# EAGLE design E-P-099-R2.8 (EAGLE 9.0.0)
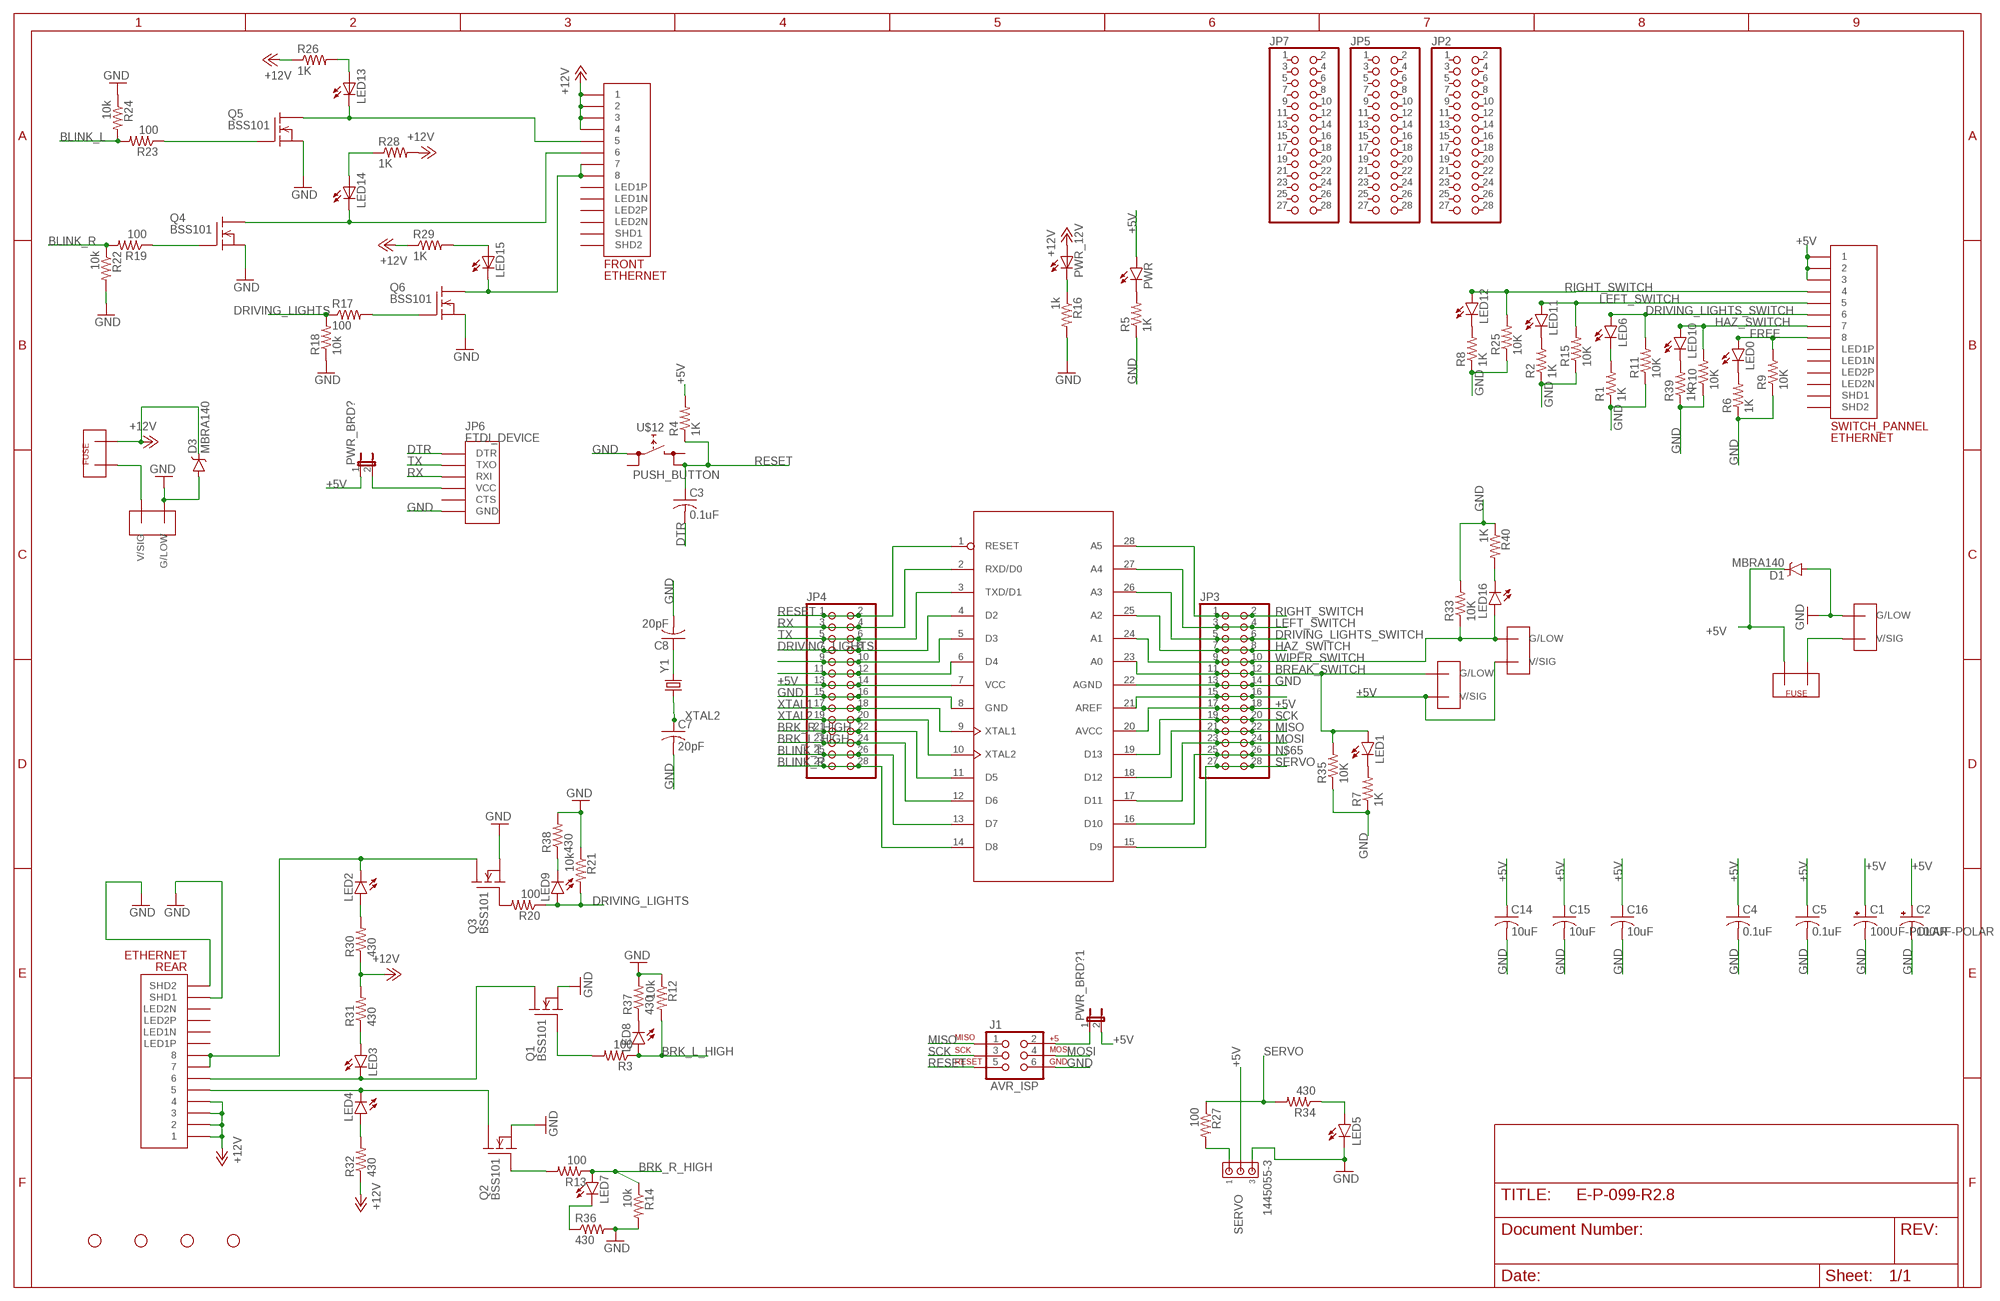
[diagram p0: schematic, sheet 1]

## Parts
C1  100UF-POLAR  [EEU-FR1H101]
C2  100UF-POLAR  [EEU-FR1H101]
C3  0.1uF  C-USC0805  [C0805]
C4  0.1uF  C-USC0805  [C0805]
C5  0.1uF  C-USC0805  [C0805]
C7  20pF  C-USC0805  [C0805]
C8  20pF  C-USC0805  [C0805]
C14  10uF  C-USC0805  [C0805]
C15  10uF  C-USC0805  [C0805]
C16  10uF  C-USC0805  [C0805]
D1  MBRA140  [SMA-DIODE]
D3  MBRA140  [SMA-DIODE]
FRONT  ETHERNET  [A122645-ND]
J1  AVR_ISP  AVR_SPI_PRG_6PTH  [2X3]
JP2  PINHD-2X14  [2X14]
JP3  PINHD-2X14  [2X14]
JP4  PINHD-2X14  [2X14]
JP5  PINHD-2X14  [2X14]
JP6  FTDI_DEVICE  [FTDI_DEVICE_SIDE]
JP7  PINHD-2X14  [2X14]
LED0  LED0603  [LED-0603]
LED1  LED0603  [LED-0603]
LED2  LED0603  [LED-0603]
LED3  LED0603  [LED-0603]
LED4  LED0603  [LED-0603]
LED5  LED0603  [LED-0603]
LED6  LED0603  [LED-0603]
LED7  LED0603  [LED-0603]
LED8  LED0603  [LED-0603]
LED9  LED0603  [LED-0603]
LED10  LED0603  [LED-0603]
LED11  LED0603  [LED-0603]
LED12  LED0603  [LED-0603]
LED13  LEDCHIPLED_0805  [CHIPLED_0805]
LED14  LEDCHIPLED_0805  [CHIPLED_0805]
LED15  LEDCHIPLED_0805  [CHIPLED_0805]
LED16  LED0603  [LED-0603]
PWR  LED0603  [LED-0603]
PWR_12V  LEDCHIPLED_1206  [CHIPLED_1206]
PWR_BRD?  JP1E  [JP1]
PWR_BRD?1  JP1E  [JP1]
Q1  BSS101  [TO92]
Q2  BSS101  [TO92]
Q3  BSS101  [TO92]
Q4  BSS101  [TO92]
Q5  BSS101  [TO92]
Q6  BSS101  [TO92]
R1  1K  RESISTOR0805-RES  [0805]
R2  1K  RESISTOR0805-RES  [0805]
R3  100  RESISTOR0805-RES  [0805]
R4  1K  RESISTOR0805-RES  [0805]
R5  1K  RESISTOR0805-RES  [0805]
R6  1K  RESISTOR0805-RES  [0805]
R7  1K  RESISTOR0805-RES  [0805]
R8  1K  RESISTOR0805-RES  [0805]
R9  10K  R-US_R0805  [R0805]
R10  10K  R-US_R0805  [R0805]
R11  10K  R-US_R0805  [R0805]
R12  10k  RESISTOR0805-RES  [0805]
R13  100  RESISTOR0805-RES  [0805]
R14  10k  RESISTOR0805-RES  [0805]
R15  10K  R-US_R0805  [R0805]
R16  1k  RESISTOR0805-RES  [0805]
R17  100  RESISTOR0805-RES  [0805]
R18  10k  RESISTOR0805-RES  [0805]
R19  100  RESISTOR0805-RES  [0805]
R20  100  RESISTOR0805-RES  [0805]
R21  10k  RESISTOR0805-RES  [0805]
R22  10k  RESISTOR0805-RES  [0805]
R23  100  RESISTOR0805-RES  [0805]
R24  10k  RESISTOR0805-RES  [0805]
R25  10K  R-US_R0805  [R0805]
R26  1K  RESISTOR0805-RES  [0805]
R27  100  RESISTOR0805-RES  [0805]
R28  1K  RESISTOR0805-RES  [0805]
R29  1K  RESISTOR0805-RES  [0805]
R30  430  RESISTOR0805-RES  [0805]
R31  430  RESISTOR0805-RES  [0805]
R32  430  RESISTOR0805-RES  [0805]
R33  10K  R-US_R0805  [R0805]
R34  430  RESISTOR0805-RES  [0805]
R35  10K  R-US_R0805  [R0805]
R36  430  RESISTOR0805-RES  [0805]
R37  430  RESISTOR0805-RES  [0805]
R38  430  RESISTOR0805-RES  [0805]
R39  1K  RESISTOR0805-RES  [0805]
R40  1K  RESISTOR0805-RES  [0805]
REAR  ETHERNET  [A122645-ND]
SERVO  1445055-3  [1445055-3]
STANDOFF1  STAND-OFF  [STAND-OFF]
STANDOFF2  STAND-OFF  [STAND-OFF]
STANDOFF3  STAND-OFF  [STAND-OFF]
STANDOFF4  STAND-OFF  [STAND-OFF]
SWITCH_PANNEL  ETHERNET  [A122645-ND]
U$1  TE770966  [2X1-MATE-N-LOCK]
U$2  FUSEMINI-BLADE  [MINI-BLADE-FUSE]
U$3  TE770966  [2X1-MATE-N-LOCK]
U$4  ATMEGA328  [DIP28-0.3IN]
U$5  TE770966  [2X1-MATE-N-LOCK]
U$8  TE770966  [2X1-MATE-N-LOCK]
U$9  FUSEMINI-BLADE  [MINI-BLADE-FUSE]
U$12  PUSH_BUTTON  [PUSHBUTTON]
Y1  CRYSTALHC49US  [HC49US]

## Nets
+5V: C1.P(+) C2.P(+) C4.1 C5.1 C14.1 C15.1 C16.1 D1.C JP3.17 JP3.18 JP4.13 JP4.14 PWR.A PWR_BRD?1.2 PWR_BRD?.1 R4.2 SERVO.2 SWITCH_PANNEL.P$1 SWITCH_PANNEL.P$2 SWITCH_PANNEL.P$3 U$2.OUT U$3.CIRCUIT1(V/SIG) U$4.7(VCC) U$4.20(AVCC) U$5.CIRCUIT1(V/SIG)
+12V: D3.C FRONT.P$1 FRONT.P$2 FRONT.P$3 FRONT.P$4 PWR_12V.A R26.1 R28.2 R29.1 R30.1 R31.2 R32.1 REAR.P$1 REAR.P$2 REAR.P$3 REAR.P$4 U$9.OUT
BLINK_L: JP4.25 JP4.26 R23.2 R24.2 U$4.13(D7)
BLINK_R: JP4.27 JP4.28 R19.2 R22.1 U$4.14(D8)
BREAK_SWITCH: JP3.11 JP3.12 LED1.A R35.2 U$3.CIRCUIT2(G/LOW) U$4.23(A0)
BRK_L_HIGH: JP4.23 JP4.24 LED8.A R3.1 R12.2 U$4.12(D6)
BRK_R_HIGH: JP4.21 JP4.22 LED7.A R13.1 R14.1 U$4.11(D5)
DRIVING_LIGHTS: JP4.7 JP4.8 LED9.A R17.1 R18.2 R20.1 R21.2 U$4.4(D2)
DRIVING_LIGHTS_SWITCH: JP3.5 JP3.6 LED6.A R11.2 SWITCH_PANNEL.P$6 U$4.26(A3)
DTR: C3.2 JP6.P$1(DTR)
FREE: LED0.A R9.2 SWITCH_PANNEL.P$8
GND: C1.G(-) C2.G(-) C4.2 C5.2 C7.2 C8.2 C14.2 C15.2 C16.2 D1.A D3.A J1.6 JP3.13 JP3.14 JP4.15 JP4.16 JP6.P$6(GND) LED5.C Q1.1(S) Q2.1(S) Q3.1(S) Q4.1(S) Q5.1(S) Q6.1(S) R1.1 R2.1 R5.1 R6.1 R7.1 R8.1 R9.1 R10.1 R11.1 R12.1 R14.2 R15.1 R16.2 R18.1 R21.1 R22.2 R24.1 R25.1 R33.2 R35.1 R36.2 R37.2 R38.2 R39.1 R40.1 REAR.P$13(SHD1) REAR.P$14(SHD2) SERVO.3 U$1.CIRCUIT2(G/LOW) U$4.8(GND) U$4.22(AGND) U$8.CIRCUIT2(G/LOW) U$12.L1(L)
HAZ_SWITCH: JP3.7 JP3.8 LED10.A R10.2 SWITCH_PANNEL.P$7 U$4.25(A2)
LEFT_SWITCH: JP3.3 JP3.4 LED11.A R15.2 SWITCH_PANNEL.P$5 U$4.27(A4)
MISO: J1.1 JP3.21 JP3.22 U$4.18(D12)
MOSI: J1.4 JP3.23 JP3.24 U$4.17(D11)
N$1: LED12.C R8.2
N$2: LED6.C R1.2
N$3: LED11.C R2.2
N$4: LED2.C Q3.3(D) REAR.P$7 REAR.P$8
N$5: LED3.C Q1.3(D) REAR.P$6
N$6: U$1.CIRCUIT1(V/SIG) U$2.IN
N$7: LED4.C Q2.3(D) REAR.P$5
N$8: Q3.2(G) R20.2
N$9: JP6.P$4(VCC) PWR_BRD?.2
N$10: LED0.C R6.2
N$11: LED1.C R7.2
N$12: LED5.A R34.1
N$13: R27.2 SERVO.1
N$14: Q2.2(G) R13.2
N$15: Q1.2(G) R3.2
N$16: PWR_12V.C R16.1
N$17: Q5.2(G) R23.1
N$18: LED4.A R32.2
N$19: PWR.C R5.2
N$20: FRONT.P$7 FRONT.P$8 LED15.C Q6.3(D)
N$21: FRONT.P$6 LED14.C Q4.3(D)
N$22: FRONT.P$5 LED13.C Q5.3(D)
N$23: LED3.A R31.1
N$24: C8.1 Y1.2
N$25: JP4.11 JP4.12 U$4.6(D4)
N$26: JP4.9 JP4.10 U$4.5(D3)
N$27: LED2.A R30.2
N$28: LED16.C R40.2
N$32: LED13.A R26.2
N$33: Q4.2(G) R19.1
N$34: LED14.A R28.1
N$35: Q6.2(G) R17.2
N$36: LED15.A R29.2
N$37: J1.2 PWR_BRD?1.1
N$41: LED7.C R36.1
N$42: LED8.C R37.1
N$44: LED9.C R38.1
N$46: LED10.C R39.2
N$47: U$8.CIRCUIT1(V/SIG) U$9.IN
N$60: JP3.15 JP3.16 U$4.21(AREF)
N$65: JP3.25 JP3.26 U$4.16(D10)
RESET: C3.1 J1.5 JP4.1 JP4.2 R4.1 U$4.1(RESET) U$12.R2(R)
RIGHT_SWITCH: JP3.1 JP3.2 LED12.A R25.2 SWITCH_PANNEL.P$4 U$4.28(A5)
RX: JP4.3 JP4.4 JP6.P$3(RXI) U$4.2(RXD/D0)
SCK: J1.3 JP3.19 JP3.20 U$4.19(D13)
SERVO: JP3.27 JP3.28 R27.1 R34.2 U$4.15(D9)
TX: JP4.5 JP4.6 JP6.P$2(TXO) U$4.3(TXD/D1)
WIPER_SWITCH: JP3.9 JP3.10 LED16.A R33.1 U$4.24(A1) U$5.CIRCUIT2(G/LOW)
XTAL1: JP4.17 JP4.18 U$4.9(XTAL1)
XTAL2: C7.1 JP4.19 JP4.20 U$4.10(XTAL2) Y1.1
Unconnected: FRONT.P$9(LED1N) FRONT.P$10(LED1P) FRONT.P$11(LED2N) FRONT.P$12(LED2P) FRONT.P$13(SHD1) FRONT.P$14(SHD2) JP2.1 JP2.2 JP2.3 JP2.4 JP2.5 JP2.6 JP2.7 JP2.8 JP2.9 JP2.10 JP2.11 JP2.12 JP2.13 JP2.14 JP2.15 JP2.16 JP2.17 JP2.18 JP2.19 JP2.20 JP2.21 JP2.22 JP2.23 JP2.24 JP2.25 JP2.26 JP2.27 JP2.28 JP5.1 JP5.2 JP5.3 JP5.4 JP5.5 JP5.6 JP5.7 JP5.8 JP5.9 JP5.10 JP5.11 JP5.12 JP5.13 JP5.14 JP5.15 JP5.16 JP5.17 JP5.18 JP5.19 JP5.20 JP5.21 JP5.22 JP5.23 JP5.24 JP5.25 JP5.26 JP5.27 JP5.28 JP6.P$5(CTS) JP7.1 JP7.2 JP7.3 JP7.4 JP7.5 JP7.6 JP7.7 JP7.8 JP7.9 JP7.10 JP7.11 JP7.12 JP7.13 JP7.14 JP7.15 JP7.16 JP7.17 JP7.18 JP7.19 JP7.20 JP7.21 JP7.22 JP7.23 JP7.24 JP7.25 JP7.26 JP7.27 JP7.28 REAR.P$9(LED1N) REAR.P$10(LED1P) REAR.P$11(LED2N) REAR.P$12(LED2P) SWITCH_PANNEL.P$9(LED1N) SWITCH_PANNEL.P$10(LED1P) SWITCH_PANNEL.P$11(LED2N) SWITCH_PANNEL.P$12(LED2P) SWITCH_PANNEL.P$13(SHD1) SWITCH_PANNEL.P$14(SHD2) U$12.L2(L) U$12.R1(R)

## Library data of the parts
C1 C2 = 100uF_Cap:100UF-POLAR: 100µF polarized capacitors A capacitor is a passive two-terminal electrical component used to store electrical energy temporarily in an electric field.
C3-C5 C7 C8 C14-C16 = adafruit:C-US: CAPACITOR, American symbol
D1 D3 = SparkFun-DiscreteSemi:MBRA140: 40V, 1A Schottky rectifier SMA/DO-214AC package DIO-08053; PROD_ID: DIO-08053
FRONT REAR SWITCH_PANNEL = ETHERNET-3:ETHERNET: Ethernet port with 2 leds. digikey number A122645-ND
J1 = E-P-099-R2.2:AVR_SPI_PRG_6: AVR ISP 6 Pin This is the reduced ISP connector for AVR programming. Common on Arduino. This footprint will take up less PCB space and can be used with a 10-pin to 6-pin adapter such as SKU: BOB-08508
JP2-JP5 JP7 = E-P-099-R2.2:PINHD-2X14: PIN HEADER
JP6 = SparkFun-Connectors:FTDI_DEVICE: Connector which mates to FTDI basic or FTDI cable.
LED0 LED1-LED12 LED16 PWR = SparkFun-LED:LED: LEDs Standard schematic elements and footprints for 5mm, 3mm, 1206, and 0603 sized LEDs. 5mm - Spark Fun Electronics SKU : COM-00529 (and others)
LED13-LED15 = led:LED: LED OSRAM: - CHIPLED LG R971, LG N971, LY N971, LG Q971, LY Q971, LO R971, LY R971 LH N974, LH R974 LS Q976, LO Q976, LY Q976 LO Q996 - Hyper CHIPLED LW Q18S LB Q993, LB Q99A, LB R99A - SideLED LS A670, LO A670, LY A670, LG A670, LP A670 LB A673, LV A673, LT A673, LW A673 LH A674 LY A675 LS A676, LA A676, LO A676, LY A676, LW A676 LS A679, LY A679, LG A679 - Hyper Micro SIDELED® LS Y876, LA Y876, LO Y876, LY Y876 LT Y87S - SmartLED LW L88C, LW L88S LB L89C, LB L89S, LG L890 LS L89K, LO L89K, LY L89K LS L896, LA L896, LO L896, LY L896 - TOPLED LS T670, LO T670, LY T670, LG T670, LP T670 LSG T670, LSP T670, LSY T670, LOP T670, LYG T670 LG T671, LOG T671, LSG T671 LB T673, LV T673, LT T673, LW T673 LH T674 LS T676, LA T676, LO T676, LY T676, LB T676, LH T676, LSB T676, LW T676 LB T67C, LV T67C, LT T67C, LS T67K, LO T67K, LY T67K, LW E67C LS E67B, LA E67B, LO E67B, LY E67B, LB E67C, LV E67C, LT E67C LW T67C LS T679, LY T679, LG T679 LS T770, LO T770, LY T770, LG T770, LP T770 LB T773, LV T773, LT T773, LW T773 LH T774 LS E675, LA E675, LY E675, LS T675 LS T776, LA T776, LO T776, LY T776, LB T776 LHGB T686 LT T68C, LB T68C - Hyper Mini TOPLED® LB M676 - Mini TOPLED Santana® LG M470 LS M47K, LO M47K, LY M47K Source: http://www.osram.convergy.de LUXEON: - LUMILED® LXK2-PW12-R00, LXK2-PW12-S00, LXK2-PW14-U00, LXK2-PW14-V00 LXK2-PM12-R00, LXK2-PM12-S00, LXK2-PM14-U00 LXK2-PE12-Q00, LXK2-PE12-R00, LXK2-PE12-S00, LXK2-PE14-T00, LXK2-PE14-U00 LXK2-PB12-K00, LXK2-PB12-L00, LXK2-PB12-M00, LXK2-PB14-N00, LXK2-PB14-P00, LXK2-PB14-Q00 LXK2-PR12-L00, LXK2-PR12-M00, LXK2-PR14-Q00, LXK2-PR14-R00 LXK2-PD12-Q00, LXK2-PD12-R00, LXK2-PD12-S00 LXK2-PH12-R00, LXK2-PH12-S00 LXK2-PL12-P00, LXK2-PL12-Q00, LXK2-PL12-R00 Source: www.luxeon.com KINGBRIGHT: KA-3528ASYC Source: www.kingbright.com
PWR_12V = E14-P-099-R21.2(US_drills):LED: LED OSRAM: - CHIPLED LG R971, LG N971, LY N971, LG Q971, LY Q971, LO R971, LY R971 LH N974, LH R974 LS Q976, LO Q976, LY Q976 LO Q996 - Hyper CHIPLED LW Q18S LB Q993, LB Q99A, LB R99A - SideLED LS A670, LO A670, LY A670, LG A670, LP A670 LB A673, LV A673, LT A673, LW A673 LH A674 LY A675 LS A676, LA A676, LO A676, LY A676, LW A676 LS A679, LY A679, LG A679 - Hyper Micro SIDELED® LS Y876, LA Y876, LO Y876, LY Y876 LT Y87S - SmartLED LW L88C, LW L88S LB L89C, LB L89S, LG L890 LS L89K, LO L89K, LY L89K LS L896, LA L896, LO L896, LY L896 - TOPLED LS T670, LO T670, LY T670, LG T670, LP T670 LSG T670, LSP T670, LSY T670, LOP T670, LYG T670 LG T671, LOG T671, LSG T671 LB T673, LV T673, LT T673, LW T673 LH T674 LS T676, LA T676, LO T676, LY T676, LB T676, LH T676, LSB T676, LW T676 LB T67C, LV T67C, LT T67C, LS T67K, LO T67K, LY T67K, LW E67C LS E67B, LA E67B, LO E67B, LY E67B, LB E67C, LV E67C, LT E67C LW T67C LS T679, LY T679, LG T679 LS T770, LO T770, LY T770, LG T770, LP T770 LB T773, LV T773, LT T773, LW T773 LH T774 LS E675, LA E675, LY E675, LS T675 LS T776, LA T776, LO T776, LY T776, LB T776 LHGB T686 LT T68C, LB T68C - Hyper Mini TOPLED® LB M676 - Mini TOPLED Santana® LG M470 LS M47K, LO M47K, LY M47K Source: http://www.osram.convergy.de LUXEON: - LUMILED® LXK2-PW12-R00, LXK2-PW12-S00, LXK2-PW14-U00, LXK2-PW14-V00 LXK2-PM12-R00, LXK2-PM12-S00, LXK2-PM14-U00 LXK2-PE12-Q00, LXK2-PE12-R00, LXK2-PE12-S00, LXK2-PE14-T00, LXK2-PE14-U00 LXK2-PB12-K00, LXK2-PB12-L00, LXK2-PB12-M00, LXK2-PB14-N00, LXK2-PB14-P00, LXK2-PB14-Q00 LXK2-PR12-L00, LXK2-PR12-M00, LXK2-PR14-Q00, LXK2-PR14-R00 LXK2-PD12-Q00, LXK2-PD12-R00, LXK2-PD12-S00 LXK2-PH12-R00, LXK2-PH12-S00 LXK2-PL12-P00, LXK2-PL12-Q00, LXK2-PL12-R00 Source: www.luxeon.com KINGBRIGHT: KA-3528ASYC Source: www.kingbright.com
PWR_BRD? PWR_BRD?1 = E-P-099-R2.2:JP1E: JUMPER
Q1-Q6 = transistor-fet:BSS101: N-Channel Enhancement MOSFET 200V; 0,16A; 11Ohm
R1-R8 R12-R14 R16-R24 R26-R32 R34 R36-R40 = SparkFun-Passives:RESISTOR: Resistor Basic schematic elements and footprints for 0603, 1206, and PTH resistors.
R9-R11 R15 R25 R33 R35 = resistor:R-US_: RESISTOR, American symbol
SERVO = con-amp:1445055-3: Micro MATE-N-LOK Connectors grid 1.5 mm Source: ENG_CD_1445055_A.pdf
STANDOFF1-STANDOFF4 = SparkFun-Electromechanical:STAND-OFF: #4 Stand Off This is the mechanical footprint for a #4 phillips button head screw. Use the keepout ring to avoid running the screw head into surrounding components. SKU : PRT-00447
U$1 U$3 U$5 U$8 = Shell2013(1):TE770966
U$2 U$9 = Shell2013:FUSE
U$4 = E-P-099-R2.2:ATMEGA328
U$12 = E-P-099-R2.2:PUSH_BUTTON
Y1 = SparkFun-FreqCtrl:CRYSTAL: Various standard crystals. Proven footprints.

## Board
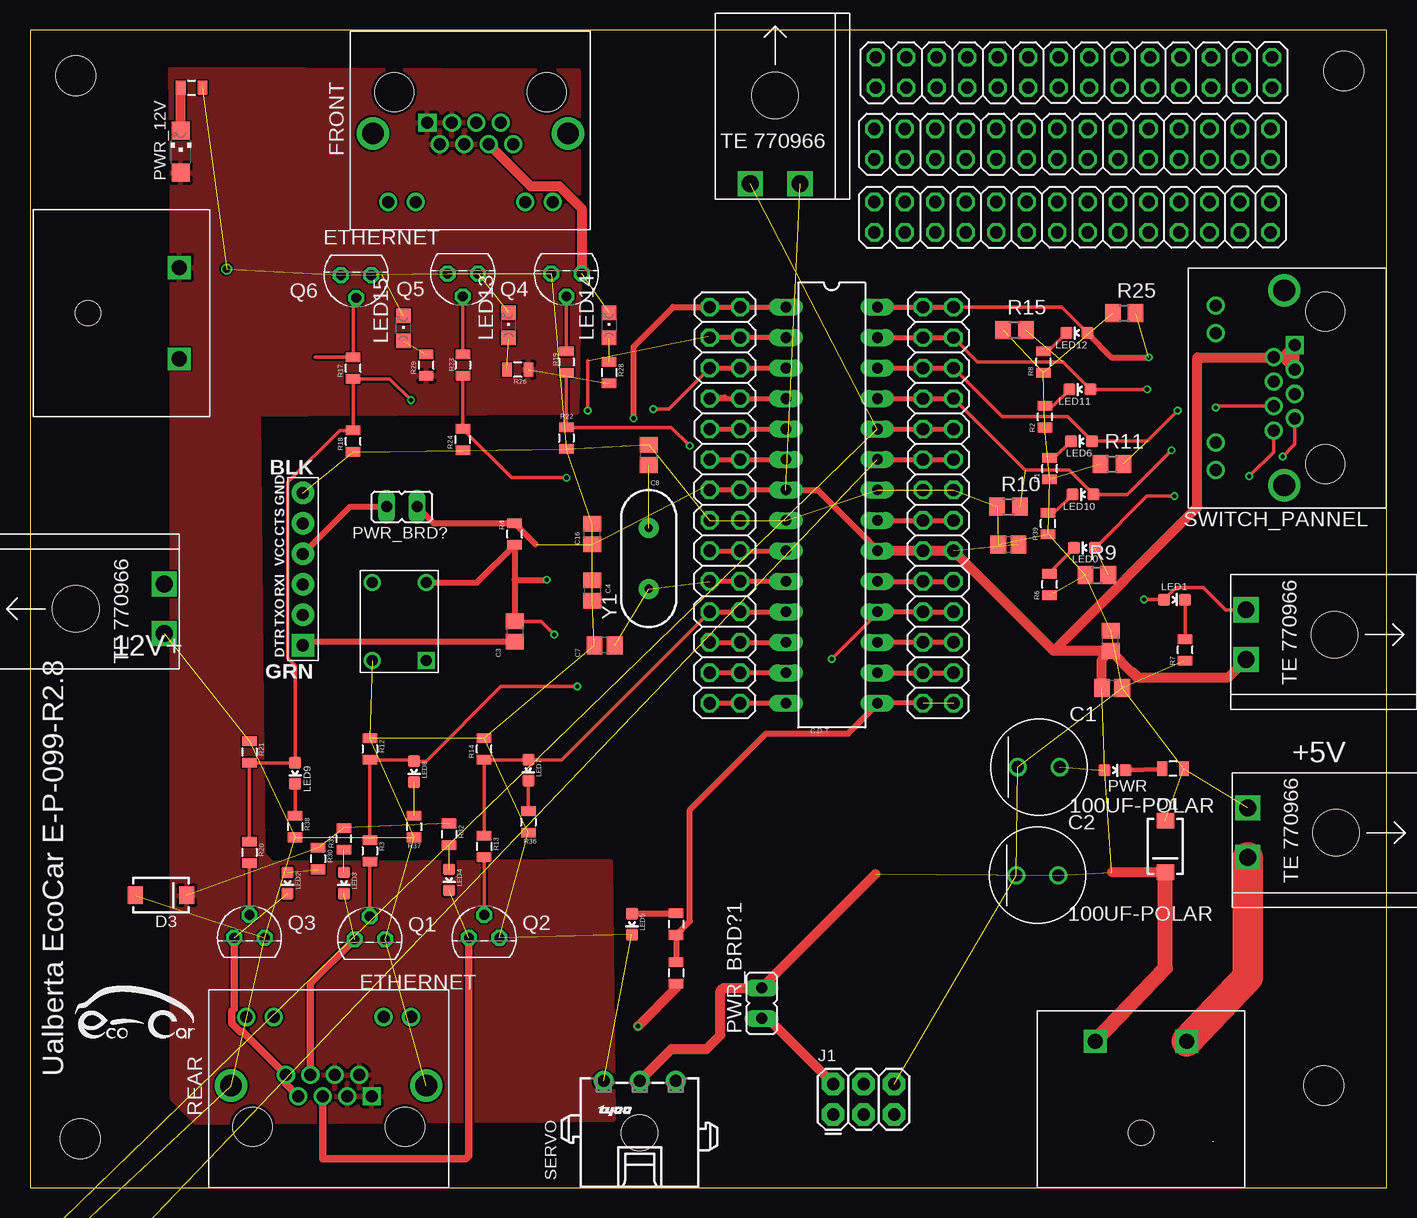
[diagram p1: board, top side]
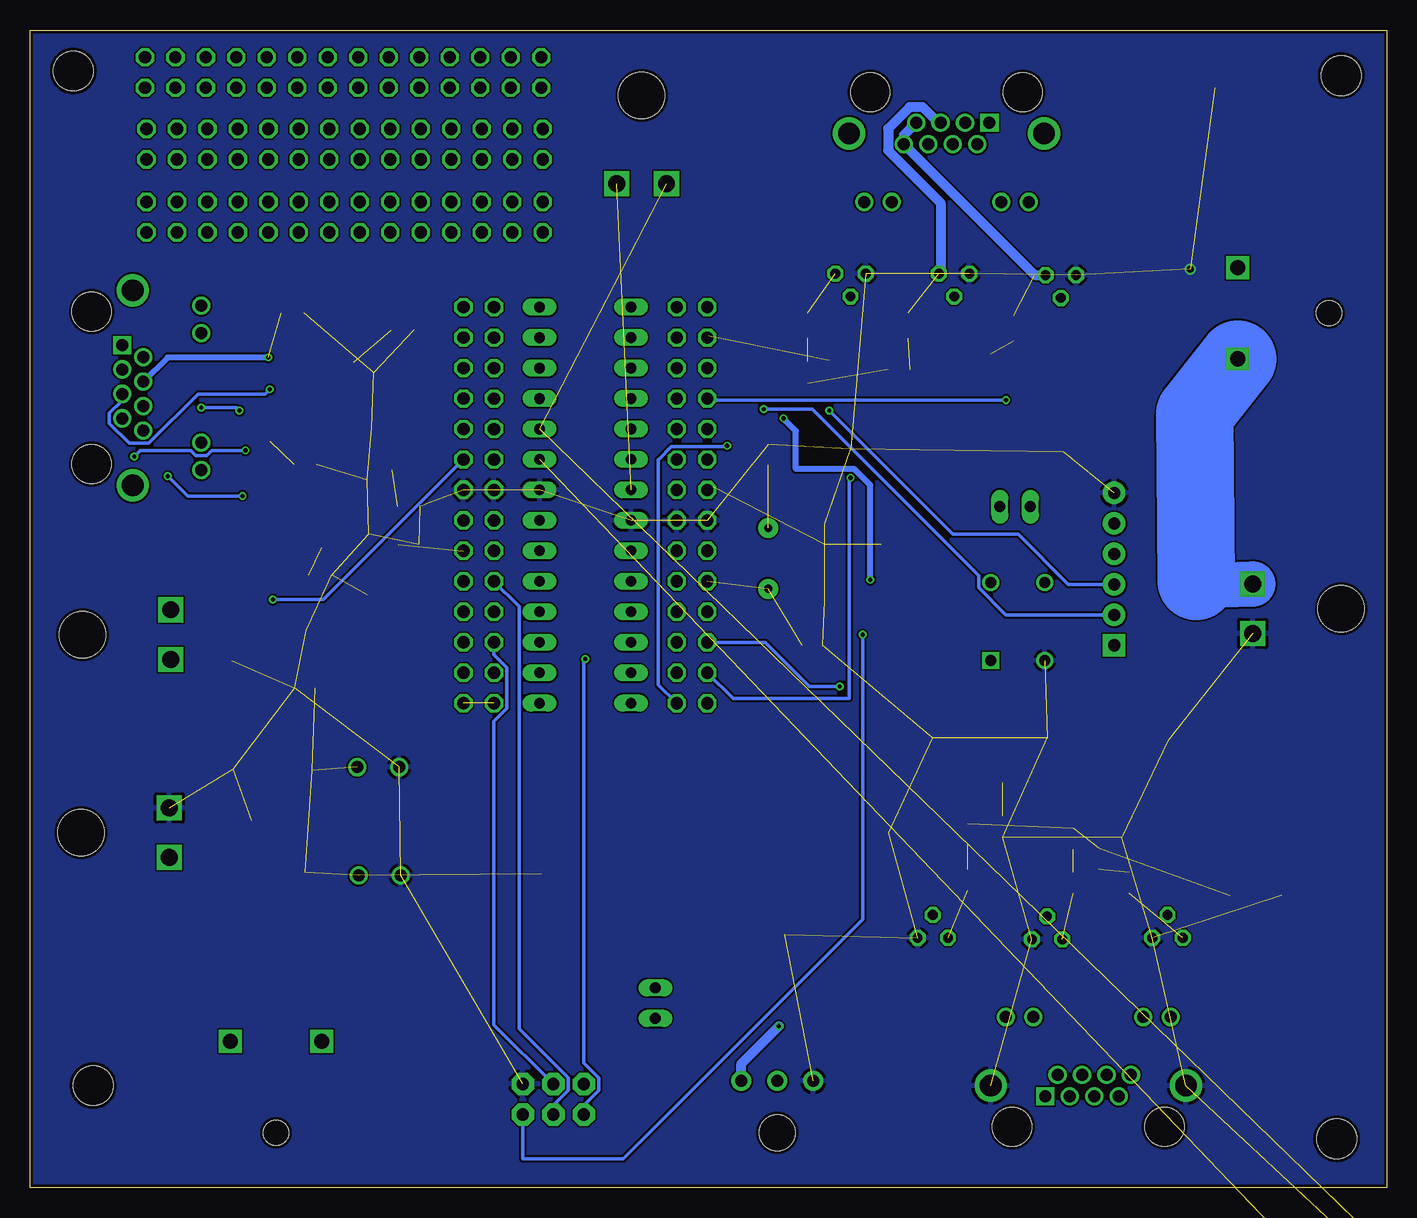
[diagram p2: board, bottom side, seen from below]

Size 113.08 x 96.51 mm. Coordinates in mm from the lower left corner, seen from the top.
Outline: 0,0 113.08,0 113.08,96.51 0,96.51 0,0
Copper layers (1*16): Top 0.035mm / dielectric 1.5mm / Bottom 0.035mm
Design rules "SeeedStudio_2layer_DRU_no_angle_20140221": minimum track width 6mil, minimum drill 12mil, track to track 6mil, track to pad 6mil, pad to pad 6mil, via to via 6mil, smd to smd 0mil, copper to edge 10mil, drill to drill 10mil, minimum pad ring 10mil, minimum via ring 6mil, stop-mask expansion 2mil, vias tented up to drill 100mil, thermal gap 10mil

### Footprints (pad centres in the part's own frame; a part is rotated, then mirrored left to right if it is on the bottom)
EEU-FR1H101 = drill 1: G -1.75,0; P 1.75,0
C0805 = smd 1.3 x 1.5: 1 -0.85,0; 2 0.85,0
SMA-DIODE = smd 1.27 x 1.47: A -2.15,0; C 2.15,0
A122645-ND = drill 1 square: P$1 3.58,2.54 | drill 1: P$2 2.56,4.32; P$3 1.54,2.54; P$4 0.52,4.32; P$5 -0.5,2.54; P$6 -1.52,4.32; P$7 -2.54,2.54; P$8 -3.56,4.32; P$9 -6.86,9.14; P$10 -4.57,9.14; P$11 4.57,9.14; P$12 6.86,9.14 | drill 1.8: P$13 -8.13,3.43; P$14 8.13,3.43 | hole 3.25: -6.35,0; 6.35,0
2X3 = drill 1.016 pad 1.88 octagon: 1 0,0; 2 0,2.54; 3 2.54,0; 4 2.54,2.54; 5 5.08,0; 6 5.08,2.54
2X14 = drill 1.016 octagon: 1 -16.51,-1.27; 2 -16.51,1.27; 3 -13.97,-1.27; 4 -13.97,1.27; 5 -11.43,-1.27; 6 -11.43,1.27; 7 -8.89,-1.27; 8 -8.89,1.27; 9 -6.35,-1.27; 10 -6.35,1.27; 11 -3.81,-1.27; 12 -3.81,1.27; 13 -1.27,-1.27; 14 -1.27,1.27; 15 1.27,-1.27; 16 1.27,1.27; 17 3.81,-1.27; 18 3.81,1.27; 19 6.35,-1.27; 20 6.35,1.27; 21 8.89,-1.27; 22 8.89,1.27; 23 11.43,-1.27; 24 11.43,1.27; 25 13.97,-1.27; 26 13.97,1.27; 27 16.51,-1.27; 28 16.51,1.27
FTDI_DEVICE_SIDE = drill 1.016 pad 1.88 square: P$1 -6.35,0 | drill 1.016 pad 1.88: P$2 -3.81,0; P$3 -1.27,0; P$4 1.27,0; P$5 3.81,0; P$6 6.35,0
LED-0603 = smd 1 x 1: A 0,-0.877; C 0,0.877
CHIPLED_0805 = smd 1.2 x 1.2: A 0,-1.05; C 0,1.05
CHIPLED_1206 = smd 1.5 x 1.5: A 0,-1.75; C 0,1.75
JP1 = drill 0.914 long: 1 0,-1.27; 2 0,1.27
TO92 = drill 0.813 octagon: 1 1.27,0; 2 0,1.905; 3 -1.27,0
0805 = smd 0.8 x 1.2: 1 -0.9,0; 2 0.9,0
R0805 = smd 1.3 x 1.5: 1 -0.95,0; 2 0.95,0
1445055-3 = drill 1 pad 1.676: 1 3,4.32; 2 0,4.32; 3 -3,4.32 | hole 3: 0,0
STAND-OFF = hole 3.302: 0,0
2X1-MATE-N-LOCK = drill 1.4 square: CIRCUIT1 -2.07,14.23; CIRCUIT2 2.07,14.23 | hole 3.86: 0,6.86
MINI-BLADE-FUSE = drill 1.27 square: IN 3.81,7.62; OUT -3.81,7.62 | hole 2.083: 0,0
DIP28-0.3IN = drill 0.889 long: 1 -16.51,-3.81; 2 -13.97,-3.81; 3 -11.43,-3.81; 4 -8.89,-3.81; 5 -6.35,-3.81; 6 -3.81,-3.81; 7 -1.27,-3.81; 8 1.27,-3.81; 9 3.81,-3.81; 10 6.35,-3.81; 11 8.89,-3.81; 12 11.43,-3.81; 13 13.97,-3.81; 14 16.51,-3.81; 15 16.51,3.81; 16 13.97,3.81; 17 11.43,3.81; 18 8.89,3.81; 19 6.35,3.81; 20 3.81,3.81; 21 1.27,3.81; 22 -1.27,3.81; 23 -3.81,3.81; 24 -6.35,3.81; 25 -8.89,3.81; 26 -11.43,3.81; 27 -13.97,3.81; 28 -16.51,3.81
PUSHBUTTON = drill 0.889: L1 0,4.5; R1 6.5,4.5; R2 6.5,0 | drill 0.889 square: L2 0,0
HC49US = drill 0.7 pad 1.651: 1 -2.54,0; 2 2.54,0

### Placement (x,y rotation side)
C1  84.07,35.05 0 top
C2  83.95,26.03 0 top
C3  40.39,46.35 270 top
C4  46.86,49.78 270 top
C5  90.04,45.59 90 top
C7  47.88,45.21 180 top
C8  51.56,61.09 90 top
C14  81.53,53.59 180 top
C15  90.17,41.66 0 top
C16  46.86,54.48 90 top
D1  94.62,28.45 270 top
D3  10.92,24.38 0 top
FRONT  36.7,91.31 180 top
J1  66.93,6.1 0 top
JP2  86.87,80.9 0 top
JP3  75.69,56.9 270 top
JP4  57.91,56.9 270 top
JP5  86.87,87 0 top
JP6  22.73,51.56 90 top
JP7  87,92.96 0 top
LED0  87.88,53.34 90 top
LED1  95.38,49.02 270 top
LED2  21.46,25.4 180 top
LED3  26.16,25.4 180 top
LED4  34.92,25.65 180 top
LED5  50.16,21.97 180 top
LED6  87.63,62.23 90 top
LED7  41.53,34.8 180 top
LED8  32,34.67 180 top
LED9  22.1,34.54 180 top
LED10  87.76,57.78 90 top
LED11  87.5,66.55 90 top
LED12  87.25,71.25 90 top
LED13  39.88,71.88 0 top
LED14  48.26,71.88 0 top
LED15  31.11,71.63 0 top
LED16  -2.29,-18.92 0 top  (outside the outline)
PWR  90.42,34.8 270 top
PWR_12V  12.57,86.36 0 top
PWR_BRD?  30.99,56.77 90 top
PWR_BRD?1  60.96,15.37 0 top
Q1  28.32,20.7 0 top
Q2  37.85,20.83 0 top
Q3  18.29,20.83 0 top
Q4  44.7,76.2 180 top
Q5  36.07,76.2 180 top
Q6  27.18,76.07 180 top
R1  84.96,59.94 90 top
R2  84.58,64.26 90 top
R3  28.32,28.07 270 top
R4  40.39,54.48 90 top
R5  95.25,34.92 180 top
R6  84.96,50.29 90 top
R7  96.27,44.83 90 top
R8  84.46,68.83 90 top
R9  88.9,51.05 0 top
R10  81.53,56.77 0 top
R11  90.17,60.32 0 top
R12  28.32,36.58 270 top
R13  37.85,28.45 270 top
R14  37.85,36.58 90 top
R15  82.04,71.5 0 top
R16  13.46,91.69 0 top
R17  26.92,68.33 90 top
R18  26.92,62.23 90 top
R19  44.7,68.83 270 top
R20  18.29,27.94 270 top
R21  18.29,36.32 270 top
R22  44.7,62.48 270 top
R23  36.07,68.58 270 top
R24  36.07,62.36 90 top
R25  91.19,72.9 0 top
R26  40.64,68.2 180 top
R27  53.85,17.91 270 top
R28  48.26,67.95 270 top
R29  33.02,68.58 90 top
R30  24,27.43 270 top
R31  26.16,29.08 90 top
R32  34.92,29.46 270 top
R33  -2.03,-8.13 0 top  (outside the outline)
R34  53.85,21.97 270 top
R35  -2.03,-14.35 0 top  (outside the outline)
R36  41.53,30.48 270 top
R37  32,30.1 270 top
R38  22.1,30.1 270 top
R39  84.84,55.37 90 top
R40  -5.59,-18.29 0 top  (outside the outline)
REAR  24.89,5.08 0 top
SERVO  50.8,4.57 0 top
STANDOFF1  107.82,8.51 0 top
STANDOFF2  109.47,93.09 0 top
STANDOFF3  4.19,4.06 0 top
STANDOFF4  3.81,92.71 0 top
SWITCH_PANNEL  107.95,66.67 90 top
U$1  115.7,29.59 90 top
U$2  92.58,4.57 0 top
U$3  115.57,46.1 90 top
U$4  66.8,56.9 270 top
U$5  62.1,97.92 180 top
U$8  -3.05,48.26 270 top
U$9  4.83,72.9 270 top
U$12  33.02,43.94 90 top
Y1  51.56,52.45 90 top

### Tracks (layer width: path | path; a pad name or v marks a point on that pad's centre or on a via)
+5V  (10 unrouted)
  Top 0.406: U$4.7 JP4.14 JP4.13 56.26,58.42 | 56.26,58.42 56.13,58.42 | 56.22,58.38 56.26,58.42
  Top 0.508: 42.14,53.63 R4.2 33.64,55.38 PWR_BRD?.1 | U$4.7 65.66,58.17 70.74,53.09
  Top 0.813: D1.C 90.15,26.3 | C15.1 89.32,44.02 C5.1 | C5.1 85.31,44.74 | 85.31,44.74 JP3.18 JP3.17 70.74,53.09 U$4.20 | 70.47,26.15 PWR_BRD?1.2 57.78,16.64 57.53,16.38 57.53,12.7 56.39,11.56 53.46,11.56 SERVO.2 | 85.31,44.74 97.28,56.72 97.28,69.22 103.61,69.22 | 103.61,69.22 SWITCH_PANNEL.P$2 104.39,69.23 SWITCH_PANNEL.P$3 SWITCH_PANNEL.P$1 104.37,69.22 103.61,69.22 | C5.1 91.82,42.96 91.9,42.96 92.23,42.64 92.23,42.56 92.24,42.55 99.85,42.55 U$3.CIRCUIT1
  Top 1.27: U$2.OUT 94.62,18.29 D1.C
  Bottom 0.406: 69.47,53.34 U$4.20
  Bottom 1.27: 88.8,12.47 U$2.OUT
+12V  (4 unrouted)
  pour Top (rank 3): 19.05,64.52 23.11,64.52 45.59,64.64 45.85,78.23 45.72,79.25 45.72,93.09 11.68,93.22 11.81,83.31 11.81,7.49 13.84,5.46 48.64,5.71 48.39,27.18 27.18,27.05 20.19,27.05 19.43,27.81
BLINK_L  (via drill 0.35)
  Top 0.305: R23.2 R24.2 40.14,59.18 v44.7,59.18
  Top 0.406: U$4.13 JP4.26 JP4.25
  Bottom 0.305: v44.7,59.18 44.83,59.05 44.83,40.77 54.48,40.77 JP4.25
BLINK_R  (via drill 0.35)
  Top 0.305: R19.2 R22.1 53.46,63.38 v54.99,61.85 | U$4.14 62.99,40.81
  Top 0.406: JP4.27 JP4.28 U$4.14
  Bottom 0.305: JP4.28 60.71,41.91 60.71,60.71 60.69,60.71 59.62,61.77 55.07,61.77 v54.99,61.85
BREAK_SWITCH  (via drill 0.35)  (1 unrouted)
  Top 0.305: v92.84,49.02 94.49,49.02 | 94.49,49.02 LED1.A | U$3.CIRCUIT2 99.66,48.17 97.79,50.04 95.5,50.04 94.49,49.02
  Top 0.406: U$4.23 JP3.11 JP3.12
  Bottom 0.305: v92.84,49.02 88.65,49.02 JP3.12
BRK_L_HIGH  (via drill 0.35)
  Top 0.305: R3.1 R12.2 31.88,35.68 LED8.A 33.01,35.55 39.24,41.78 v45.59,41.78
  Top 0.406: JP4.23 JP4.24 U$4.12
  Bottom 0.305: v45.59,41.78 48.13,41.78 51.82,45.47 JP4.23
BRK_R_HIGH
  Top 0.305: R13.1 R14.1 LED7.A 44.31,35.67 JP4.21
  Top 0.406: JP4.21 JP4.22 U$4.11
DRIVING_LIGHTS  (via drill 0.35)
  Top 0.305: R20.1 R21.2 LED9.A 22.1,43.54 21.49,44.15 21.49,58.83 25.79,63.13 R18.2 R17.1 29.98,67.43 v31.75,65.66
  Top 0.406: 57.91,65.91 JP4.7 JP4.8 U$4.4
  Bottom 0.305: v31.75,65.66 56.52,65.66 JP4.7
DRIVING_LIGHTS_SWITCH  (via drill 0.35)  (1 unrouted)
  Top 0.305: v95.63,64.77 93.09,62.23 LED6.A 86.47,64.26 81.03,64.26 JP3.6 | v98.81,65.02 98.94,65.16 SWITCH_PANNEL.P$6
  Top 0.406: U$4.26 JP3.5 JP3.6
  Bottom 0.305: v95.63,64.77 95.88,65.02 v98.81,65.02
DTR
  Top 0.508: C3.2 23.03,45.5 JP6.P$1
FREE  (via drill 0.35)  (1 unrouted)
  Top 0.305: LED0.A 93.08,57.66 v95.38,57.66 | v101.6,59.31 103.63,61.34 SWITCH_PANNEL.P$8
  Bottom 0.305: v95.38,57.66 99.95,57.66 v101.6,59.31
GND  (via drill 0.6)  (57 unrouted)
  other vias: 16.38,76.58
  pour Bottom (rank 5): 0,96.52 113.03,96.52 113.03,0 0,0
HAZ_SWITCH  (via drill 0.35)  (1 unrouted)
  Top 0.305: LED10.A 88.65,57.78 | 88.65,57.78 91.44,57.78 v95.12,61.47 | v104.39,60.96 105.41,61.98 SWITCH_PANNEL.P$7 | JP3.8 82.93,59.82 86.61,59.82 88.65,57.78
  Top 0.406: U$4.25 JP3.7 JP3.8
  Bottom 0.305: v104.39,60.96 103.89,61.47 99.67,61.47 99.25,61.05 98.37,61.05 97.95,61.47 v95.12,61.47
LEFT_SWITCH  (via drill 0.35)  (1 unrouted)
  Top 0.305: v93.09,66.55 LED11.A 86.09,68.83 78.99,68.83 JP3.4
  Top 0.406: U$4.27 JP3.3 JP3.4
  Bottom 0.305: v93.09,66.55 93.46,66.17 99.07,66.17 103.19,62.06 104.83,62.06 106.47,63.7 106.47,64.57 105.41,65.63 SWITCH_PANNEL.P$5
MISO  (via drill 0.35)
  Top 0.305: v66.8,44.07 70.61,47.88 U$4.18
  Top 0.406: JP3.22 JP3.21 U$4.18
  Bottom 0.305: v66.8,44.07 66.93,43.94 66.93,10.4 65.68,9.15 65.68,8.12 66.93,6.88 J1.1
  Bottom 0.406: U$4.18 71.66,48.26
MOSI
  Top 0.406: JP3.24 JP3.23 U$4.17
  Bottom 0.305: J1.4 74.42,13.59 74.42,38.88 73.35,39.94 73.35,43.37 74.42,44.43 JP3.23
N$1
  Top 0.305: LED12.C 84.86,69.73 R8.2
N$2
  Top 0.305: LED6.C 85.37,60.84 R1.2
N$3
  Top 0.305: LED11.C 85.24,65.16 R2.2
N$4  (1 unrouted)
  Top 0.61: REAR.P$7 21.33,8.64 REAR.P$8 17.72,13.01 17.53,13.01 16.82,13.72 16.82,14.72 17.02,14.92 Q3.3
N$5  (1 unrouted)
  Top 0.61: Q1.3 23.37,17.02 REAR.P$6
N$6
  Top 2.54: U$2.IN 101.47,17.52 U$1.CIRCUIT1
N$7  (1 unrouted)
  Top 0.61: Q2.3 36.58,2.67 36.32,2.41 24.38,2.41 REAR.P$5
N$8
  Top 0.305: R20.2 Q3.2
N$9
  Top 0.508: JP6.P$4 26.67,56.77 PWR_BRD?.2
N$10
  Top 0.305: LED0.C 84.96,51.3 R6.2
N$11
  Top 0.305: LED1.C 96.25,45.74 R7.2
N$12
  Top 0.508: LED5.A 53.83,22.85 R34.1
N$13  (via drill 0.35)
  Top 0.813: v50.67,13.46 53.85,16.64 R27.2
  Bottom 0.813: SERVO.1 53.8,10.34 v50.67,13.46
N$14
  Top 0.305: R13.2 Q2.2
N$15
  Top 0.305: R3.2 Q1.2
N$16
  Top 0.813: PWR_12V.C R16.1
N$17
  Top 0.305: Q5.2 R23.1
N$18  (1 unrouted)
N$19
  Top 0.406: PWR.C 91.32,34.82 R5.2
N$20  (1 unrouted)
  Bottom 0.813: FRONT.P$7 40.26,87.75 FRONT.P$8 29.34,76.07 Q6.3
N$21  (1 unrouted)
  Top 0.813: FRONT.P$6 41.73,83.49 44.11,83.49 45.97,81.62 Q4.3
N$22  (1 unrouted)
  Bottom 0.813: Q5.3 37.2,76.33 37.2,82.08 41.58,86.45 41.58,88.3 39.79,90.09 38.7,90.09 37.39,88.77 FRONT.P$5
N$23  (1 unrouted)
N$24  (1 unrouted)
N$25
  Top 0.406: JP4.11 JP4.12 U$4.6
N$26
  Top 0.406: JP4.9 JP4.10 U$4.5
N$27  (1 unrouted)
N$28  (1 unrouted)
N$32  (1 unrouted)
N$33
  Top 0.305: R19.1 Q4.2
N$34  (1 unrouted)
N$35
  Top 0.305: 23.75,69.23 R17.2 26.92,73.91 Q6.2
N$36  (1 unrouted)
N$37
  Top 0.813: J1.2 61.47,14.1 PWR_BRD?1.1
N$41
  Top 0.305: LED7.C R36.1
N$42  (1 unrouted)
N$44
  Top 0.305: R38.1 LED9.C
N$46
  Top 0.305: LED10.C 85.37,56.27 R39.2
N$47
  Bottom 3.81: U$8.CIRCUIT1 16.26,50.16 15.88,50.55
  Bottom 6.452: 15.88,50.55 16,64.52 | 15.88,64.26 16,64.52 | 16,64.52 U$9.IN
N$60
  Top 0.406: U$4.21 JP3.15 JP3.16
N$65
  Top 0.406: U$4.16 JP3.25 JP3.26
RESET  (via drill 0.35)
  Top 0.305: C3.1 42.58,47.2 v43.69,46.1
  Top 0.406: JP4.1 JP4.2 U$4.1
  Top 0.508: 40.39,50.67 R4.1 37.25,50.44 U$12.R2 | 40.39,50.67 C3.1 | 40.39,50.67 v43.05,50.67 | v50.29,64.14 50.29,70.1 53.59,73.41 JP4.1
  Bottom 0.305: v43.69,46.1 43.69,22.35 63.63,2.41 72.01,2.41 J1.5
  Bottom 0.508: v43.05,50.67 43.05,58.57 44.4,59.92 49.25,59.92 49.25,63.09 v50.29,64.14 | J1.5 72.01,6.73
RIGHT_SWITCH  (via drill 0.35)  (1 unrouted)
  Top 0.305: LED12.A 85.97,73.41 JP3.2
  Top 0.406: U$4.28 JP3.1 JP3.2
  Top 0.508: LED12.A 90.16,69.22 v93.22,69.22
  Bottom 0.508: v93.22,69.22 101.61,69.22 SWITCH_PANNEL.P$4
RX  (via drill 0.35)  (1 unrouted)
  Top 0.305: v46.48,64.77 46.48,68.96
  Top 0.406: U$4.2 JP4.4 JP4.3
  Bottom 0.305: JP6.P$3 26.54,50.29 30.73,54.48 36.2,54.48 v46.48,64.77 | 56.52,70.99 JP4.3
SCK
  Top 0.406: U$4.19 JP3.19 JP3.20
  Bottom 0.305: J1.3 69.47,6.88 68.22,8.12 68.22,9.15 72.31,13.24 72.31,48.44 JP3.19
SERVO  (1 unrouted)
  Top 0.406: JP3.27 70.74,40.39 U$4.15
  Top 0.508: R27.1 R34.2 54.99,22.21 54.99,31.5 61.34,37.85 68.2,37.85 70.74,40.39
TX  (via drill 0.35)
  Top 0.305: v51.94,64.9 53.21,64.9 JP4.5
  Top 0.406: JP4.5 JP4.6 U$4.3
  Bottom 0.305: JP6.P$2 31.75,47.75 34.02,50.03 34.02,51.04 47.88,64.9 v51.94,64.9
WIPER_SWITCH  (3 unrouted)
  Top 0.406: U$4.24 JP3.9 JP3.10
XTAL1
  Top 0.406: JP4.17 JP4.18 U$4.9
  Bottom 0.305: 62.56,53.09 U$4.9
XTAL2  (2 unrouted)
  Top 0.406: U$4.10 JP4.20 JP4.19

### Text on the board
tPlace: 12V+ | C.D.T | +5V | Ualberta EcoCar E-P-099-R2.8